# Altium project GECKO3basic.PRJPCB
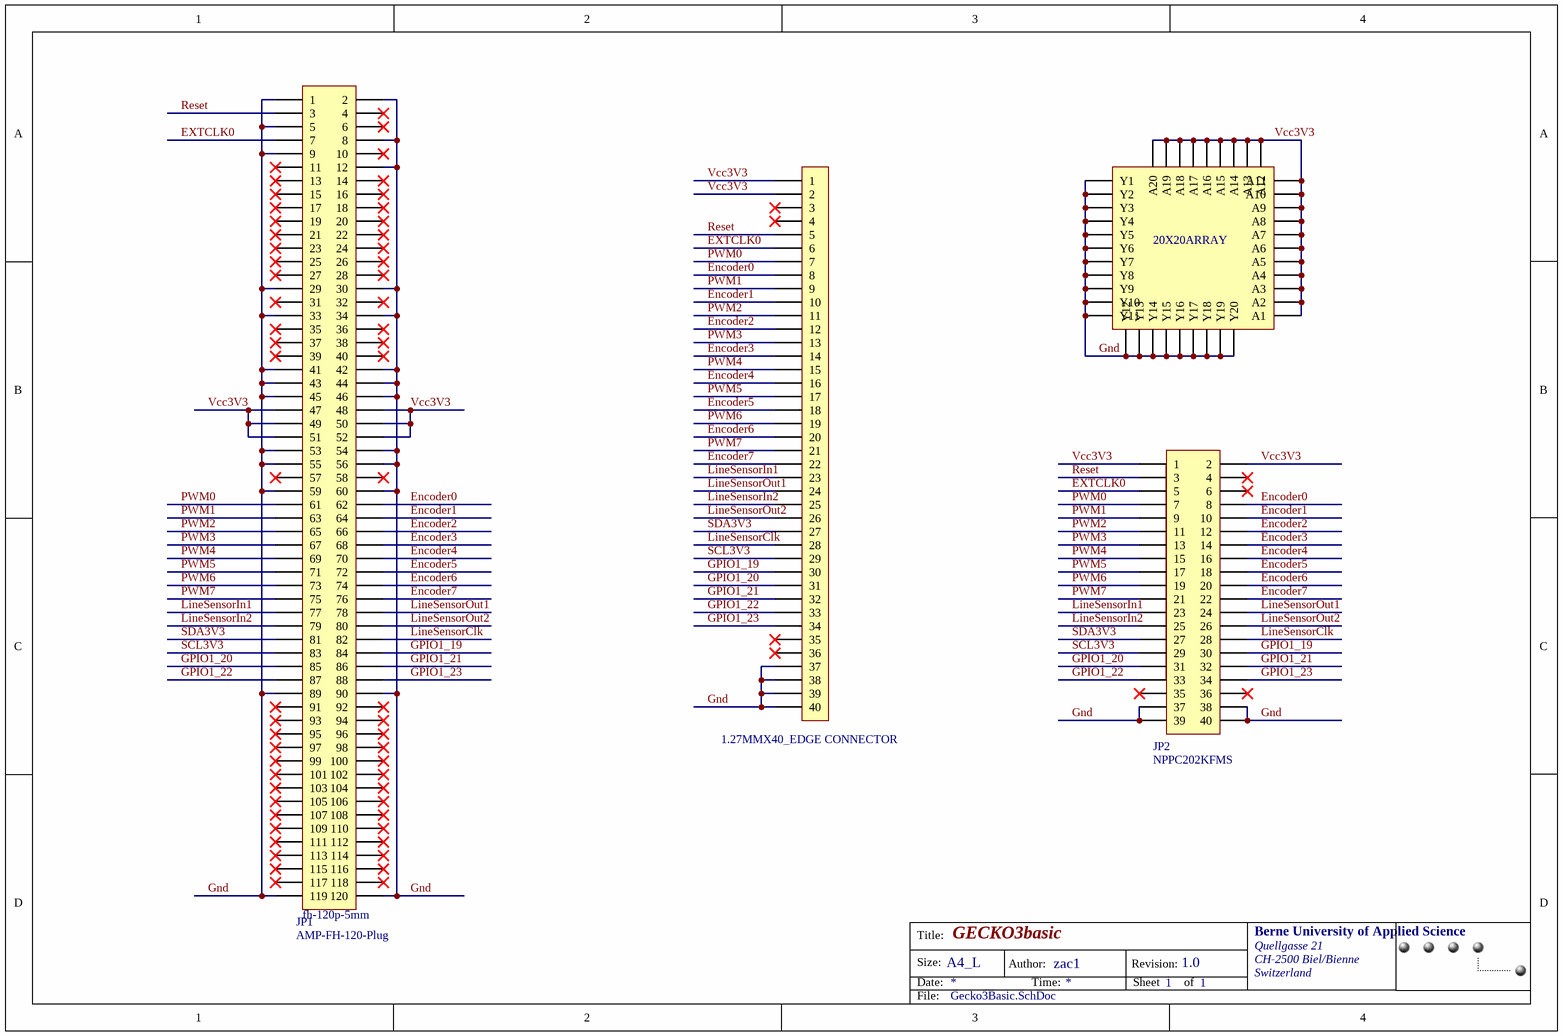
[diagram p0: Gecko3Basic.SchDoc]
1 sheet, 5 parts. Net scope: global (net labels, ports and power ports of the same name join across sheets).
Board files: GECKO3Basic.PCBDOC, basic_and_adapter_panel.PcbDoc, basic_and_adapter_panel_stencil.PcbDoc

## Sheet Gecko3Basic.SchDoc: GECKO3basic
size A4; Organization: Berne University of Applied Science; Address1: Quellgasse 21; Address2: CH-2500 Biel/Bienne; Address3: Switzerland; Revision: 1.0; SheetNumber: 1; SheetTotal: 1; Author: zac1

### Parts
Array_1  20X20ARRAY  [PGA400x20]
JP1  AMP-FH-120-Plug  value fh-120p-5mm  [amp_FH_.8mm_120pin_plug]
JP2  NPPC202KFMS  [NPPC202KFMS]
SIP_1  1.27MMX40_EDGE CONNECTOR  [1.27mm_EdgeConnector]
  CC License  [CC-License]  (value not drawn)

### Nets
Encoder0: JP1.62 JP2.8 SIP_1.8
Encoder1: JP1.64 JP2.10 SIP_1.10
Encoder2: JP1.66 JP2.12 SIP_1.12
Encoder3: JP1.68 JP2.14 SIP_1.14
Encoder4: JP1.70 JP2.16 SIP_1.16
Encoder5: JP1.72 JP2.18 SIP_1.18
Encoder6: JP1.74 JP2.20 SIP_1.20
Encoder7: JP1.76 JP2.22 SIP_1.22
EXTCLK0: JP1.7 JP2.5 SIP_1.6
Gnd: Array_1.Y1 Array_1.Y2 Array_1.Y3 Array_1.Y4 Array_1.Y5 Array_1.Y6 Array_1.Y7 Array_1.Y8 Array_1.Y9 Array_1.Y10 Array_1.Y11 Array_1.Y12 Array_1.Y13 Array_1.Y14 Array_1.Y15 Array_1.Y16 Array_1.Y17 Array_1.Y18 Array_1.Y19 Array_1.Y20 JP1.1 JP1.2 JP1.5 JP1.8 JP1.9 JP1.12 JP1.29 JP1.30 JP1.33 JP1.34 JP1.41 JP1.42 JP1.43 JP1.44 JP1.45 JP1.46 JP1.53 JP1.54 JP1.55 JP1.56 JP1.59 JP1.60 JP1.89 JP1.90 JP1.119 JP1.120 JP2.37 JP2.38 JP2.39 JP2.40 SIP_1.37 SIP_1.38 SIP_1.39 SIP_1.40
GPIO1_19: JP1.84 JP2.30 SIP_1.30
GPIO1_20: JP1.85 JP2.31 SIP_1.31
GPIO1_21: JP1.86 JP2.32 SIP_1.32
GPIO1_22: JP1.87 JP2.33 SIP_1.33
GPIO1_23: JP1.88 JP2.34 SIP_1.34
LineSensorClk: JP1.82 JP2.28 SIP_1.28
LineSensorIn1: JP1.77 JP2.23 SIP_1.23
LineSensorIn2: JP1.79 JP2.25 SIP_1.25
LineSensorOut1: JP1.78 JP2.24 SIP_1.24
LineSensorOut2: JP1.80 JP2.26 SIP_1.26
PWM0: JP1.61 JP2.7 SIP_1.7
PWM1: JP1.63 JP2.9 SIP_1.9
PWM2: JP1.65 JP2.11 SIP_1.11
PWM3: JP1.67 JP2.13 SIP_1.13
PWM4: JP1.69 JP2.15 SIP_1.15
PWM5: JP1.71 JP2.17 SIP_1.17
PWM6: JP1.73 JP2.19 SIP_1.19
PWM7: JP1.75 JP2.21 SIP_1.21
Reset: JP1.3 JP2.3 SIP_1.5
SCL3V3: JP1.83 JP2.29 SIP_1.29
SDA3V3: JP1.81 JP2.27 SIP_1.27
Vcc3V3: Array_1.A1 Array_1.A2 Array_1.A3 Array_1.A4 Array_1.A5 Array_1.A6 Array_1.A7 Array_1.A8 Array_1.A9 Array_1.A10 Array_1.A11 Array_1.A12 Array_1.A13 Array_1.A14 Array_1.A15 Array_1.A16 Array_1.A17 Array_1.A18 Array_1.A19 Array_1.A20 JP1.47 JP1.48 JP1.49 JP1.50 JP1.51 JP1.52 JP2.1 JP2.2 SIP_1.1 SIP_1.2

Not connected (* = marked no-connect by the designer): JP1 4* 6* 10* 11* 13* 14* 15* 16* 17* 18* 19* 20* 21* 22* 23* 24* 25* 26* 27* 28* 31* 32* 35* 36* 37* 38* 39* 40* 57* 58* 91* 92* 93* 94* 95* 96* 97* 98* 99* 100* 101* 102* 103* 104* 105* 106* 107* 108* 109* 110* 111* 112* 113* 114* 115* 116* 117* 118*; JP2 4* 6* 35* 36*; SIP_1 3* 4* 35* 36*

### Notes on the sheet
- Title:
- Size:
- Date:
- A4_L
- Author:
- Time:
- Revision:
- Sheet
- of
- File:

### Library data of the parts
JP1 = AMP-FH-120-Plug: AMP Free Height System, 0.8mm, 120 Pin, Plug; Part Number: 5177984-5; Currency: CHF; Packaging unit: 1; Distributor: Farnell; Distributor Number: 1098 339; Manufacturer: AMP; Price: 7.95; RoHS: yes
JP2 = 2203-34011: Manufacturer: Sullins; Part Number: NPPC202KFMS-RC; Value: Socket 2x20,smt; Currency: $; lead time: 2 Weeks; Packaging unit: 1; Distributor: DIGIKEY; Distributor Number: S5729-ND; Price: 5.94; RoHS: yes